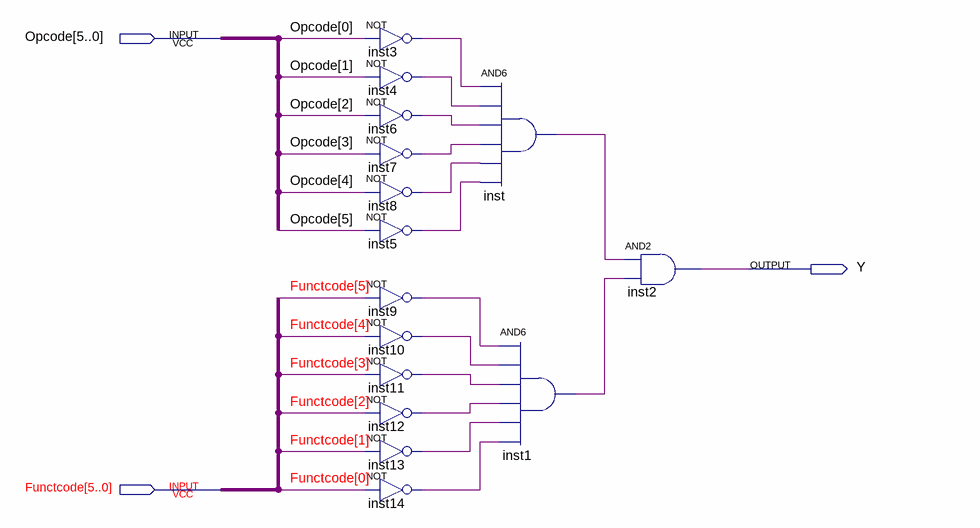
[diagram p0: schematic sheet]
// Quartus schematic SLL.bdf as structural Verilog: 15 symbols, 3 pins
module SLL (
  input  [5:0] Opcode,
  input  [5:0] Functcode,
  output Y
);

  wire inst1_out, inst3_out, inst4_out, inst5_out, inst6_out, inst7_out, inst8_out, inst9_out, inst10_out,
       inst11_out, inst12_out, inst13_out, inst14_out, inst_out;

  not inst3 (inst3_out, Opcode[0]);
  not inst4 (inst4_out, Opcode[1]);
  not inst6 (inst6_out, Opcode[2]);
  not inst7 (inst7_out, Opcode[3]);
  not inst8 (inst8_out, Opcode[4]);
  not inst5 (inst5_out, Opcode[5]);
  not inst9 (inst9_out, Functcode[5]);
  not inst10 (inst10_out, Functcode[4]);
  not inst11 (inst11_out, Functcode[3]);
  not inst12 (inst12_out, Functcode[2]);
  not inst13 (inst13_out, Functcode[1]);
  not inst14 (inst14_out, Functcode[0]);
  and inst (inst_out, inst3_out, inst4_out, inst6_out, inst7_out, inst8_out, inst5_out);
  and inst1 (inst1_out, inst9_out, inst10_out, inst11_out, inst12_out, inst13_out, inst14_out);
  and inst2 (Y, inst_out, inst1_out);
endmodule
